# Altium schematic sheet UNOCompatibleBoard.SchDoc
size A4
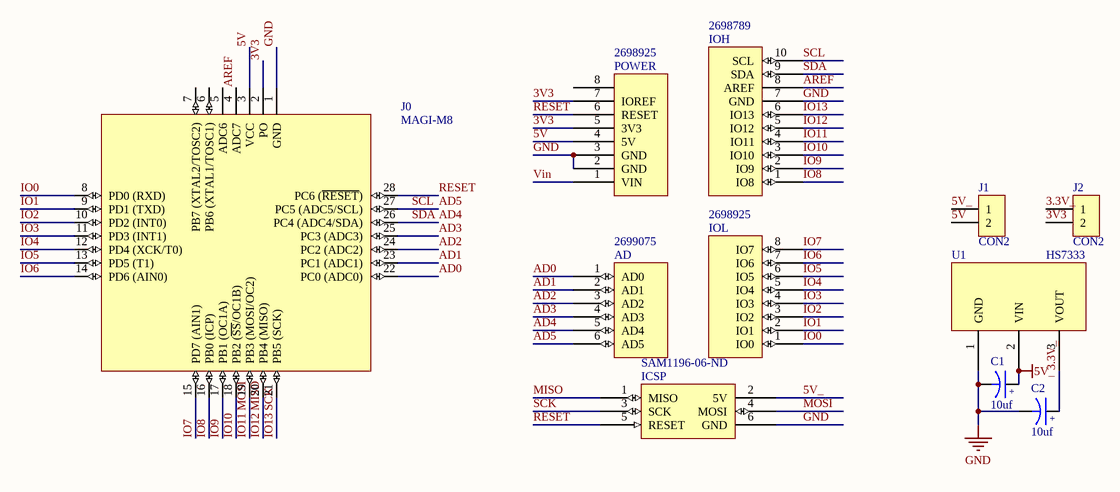
[diagram p0: UNOCompatibleBoard.SchDoc]

## Parts
AD  Supplier Part Number 4: 2699075  [Header 6x1 8.5mm]  (hidden comment: AD)
C1  10uf  [6-0805_N]
C2  10uf  [6-0805_N]
ICSP  Supplier Part Number 5: SAM1196-06-ND  [ICSP]  (hidden comment: ICSP)
IOH  Supplier Part Number 3: 2698789  [Header 10x1 8.5mm]  (hidden comment: IOH)
IOL  Supplier Part Number 4: 2698925  [Header 8x1 8.5mm]  (hidden comment: IOL)
J0  MAGI-M8  [MAGI-M8]
J1  CON2  [SIP2]
J2  CON2  [sip2]
POWER  Supplier Part Number 4: 2698925  [Header 8x1 8.5mm]  (hidden comment: POWER_UNO)
U1  HS7333  [HS7333]

## Nets
5V_: C1.1 ICSP.2(5V) J1.1 U1.2(VIN)
GND: C1.2 C2.2 ICSP.6(GND) IOH.7(GND) J0.1(GND) POWER.2(GND) POWER.3(GND) U1.1(GND)
3.3V_: C2.1 J2.1 U1.3(VOUT)
3V3: J0.2(PO) J2.2 POWER.5(3V3) POWER.7(IOREF)
5V: J0.3(VCC) J1.2 POWER.4(5V)
AD0: AD.1(AD0) J0.22(PC0_(ADC0))
AD1: AD.2(AD1) J0.23(PC1_(ADC1))
AD2: AD.3(AD2) J0.24(PC2_(ADC2))
AD3: AD.4(AD3) J0.25(PC3_(ADC3))
AD4: AD.5(AD4) IOH.9(SDA) J0.26(PC4_(ADC4/SDA))  [also labelled SDA]
AD5: AD.6(AD5) IOH.10(SCL) J0.27(PC5_(ADC5/SCL))  [also labelled SCL]
AREF: IOH.8(AREF) J0.4(ADC7)
IO0: IOL.1(IO0) J0.8(PD0_(RXD))
IO1: IOL.2(IO1) J0.9(PD1_(TXD))
IO2: IOL.3(IO2) J0.10(PD2_(INT0))
IO3: IOL.4(IO3) J0.11(PD3_(INT1))
IO4: IOL.5(IO4) J0.12(PD4_(XCK/T0))
IO5: IOL.6(IO5) J0.13(PD5_(T1))
IO6: IOL.7(IO6) J0.14(PD6_(AIN0))
IO7: IOL.8(IO7) J0.15(PD7_(AIN1))
IO8: IOH.1(IO8) J0.16(PB0_(ICP))
IO9: IOH.2(IO9) J0.17(PB1_(OC1A))
IO10: IOH.3(IO10) J0.18(PB2_(~{SS}/OC1B))
IO11: ICSP.4(MOSI) IOH.4(IO11) J0.19(PB3_(MOSI/OC2))  [also labelled MOSI]
IO12: ICSP.1(MISO) IOH.5(IO12) J0.20(PB4_(MISO))  [also labelled MISO]
IO13: ICSP.3(SCK) IOH.6(IO13) J0.21(PB5_(SCK))  [also labelled SCK]
RESET: ICSP.5(RESET) J0.28(PC6_(~{RESET})) POWER.6(RESET)
Vin: POWER.1(VIN)

Not connected (* = marked no-connect by the designer): J0 5(ADC6) 6(PB6_(XTAL1/TOSC1)) 7(PB7_(XTAL2/TOSC2)); POWER 8

## Notes on the sheet
- (in symbol CAPACITOR POL) +

## Library data of the parts
C1 C2 = CAPACITOR POL: Capacitor
J1 J2 = CON2: Connector
AD = AD: Supplier 1: Arrow; Supplier Part Number 1: 2699089; Supplier 2: Digi-Key; Supplier Part Number 2: SAM1198-06-ND; Supplier 3: Arrow; Supplier Part Number 3: 2699088; Supplier 4: Arrow
ICSP = ICSP: Supplier 1: Arrow; Supplier Part Number 1: 2699117; Supplier 2: Arrow; Supplier Part Number 2: 2699116; Supplier 3: Digi-Key; Supplier Part Number 3: SAM1185-06-ND; Supplier 4: Arrow; Supplier Part Number 4: 2699091; Supplier 5: Digi-Key
IOH = IOH: Supplier 1: Arrow; Supplier Part Number 1: 2698803S4475693N1004; Supplier 2: Digi-Key; Supplier Part Number 2: SAM1198-10-ND; Supplier 3: Arrow
IOL = IOL: Supplier 1: Digi-Key; Supplier Part Number 1: SAM1198-08-ND; Supplier 2: Arrow; Supplier Part Number 2: 2698939; Supplier 3: Arrow; Supplier Part Number 3: 2698940; Supplier 4: Arrow
POWER = POWER_UNO: Supplier 1: Digi-Key; Supplier Part Number 1: SAM1198-08-ND; Supplier 2: Arrow; Supplier Part Number 2: 2698939; Supplier 3: Arrow; Supplier Part Number 3: 2698940; Supplier 4: Arrow